# EAGLE design ACS712 - Rian Turibio - 14209393 (EAGLE 9.6.2)
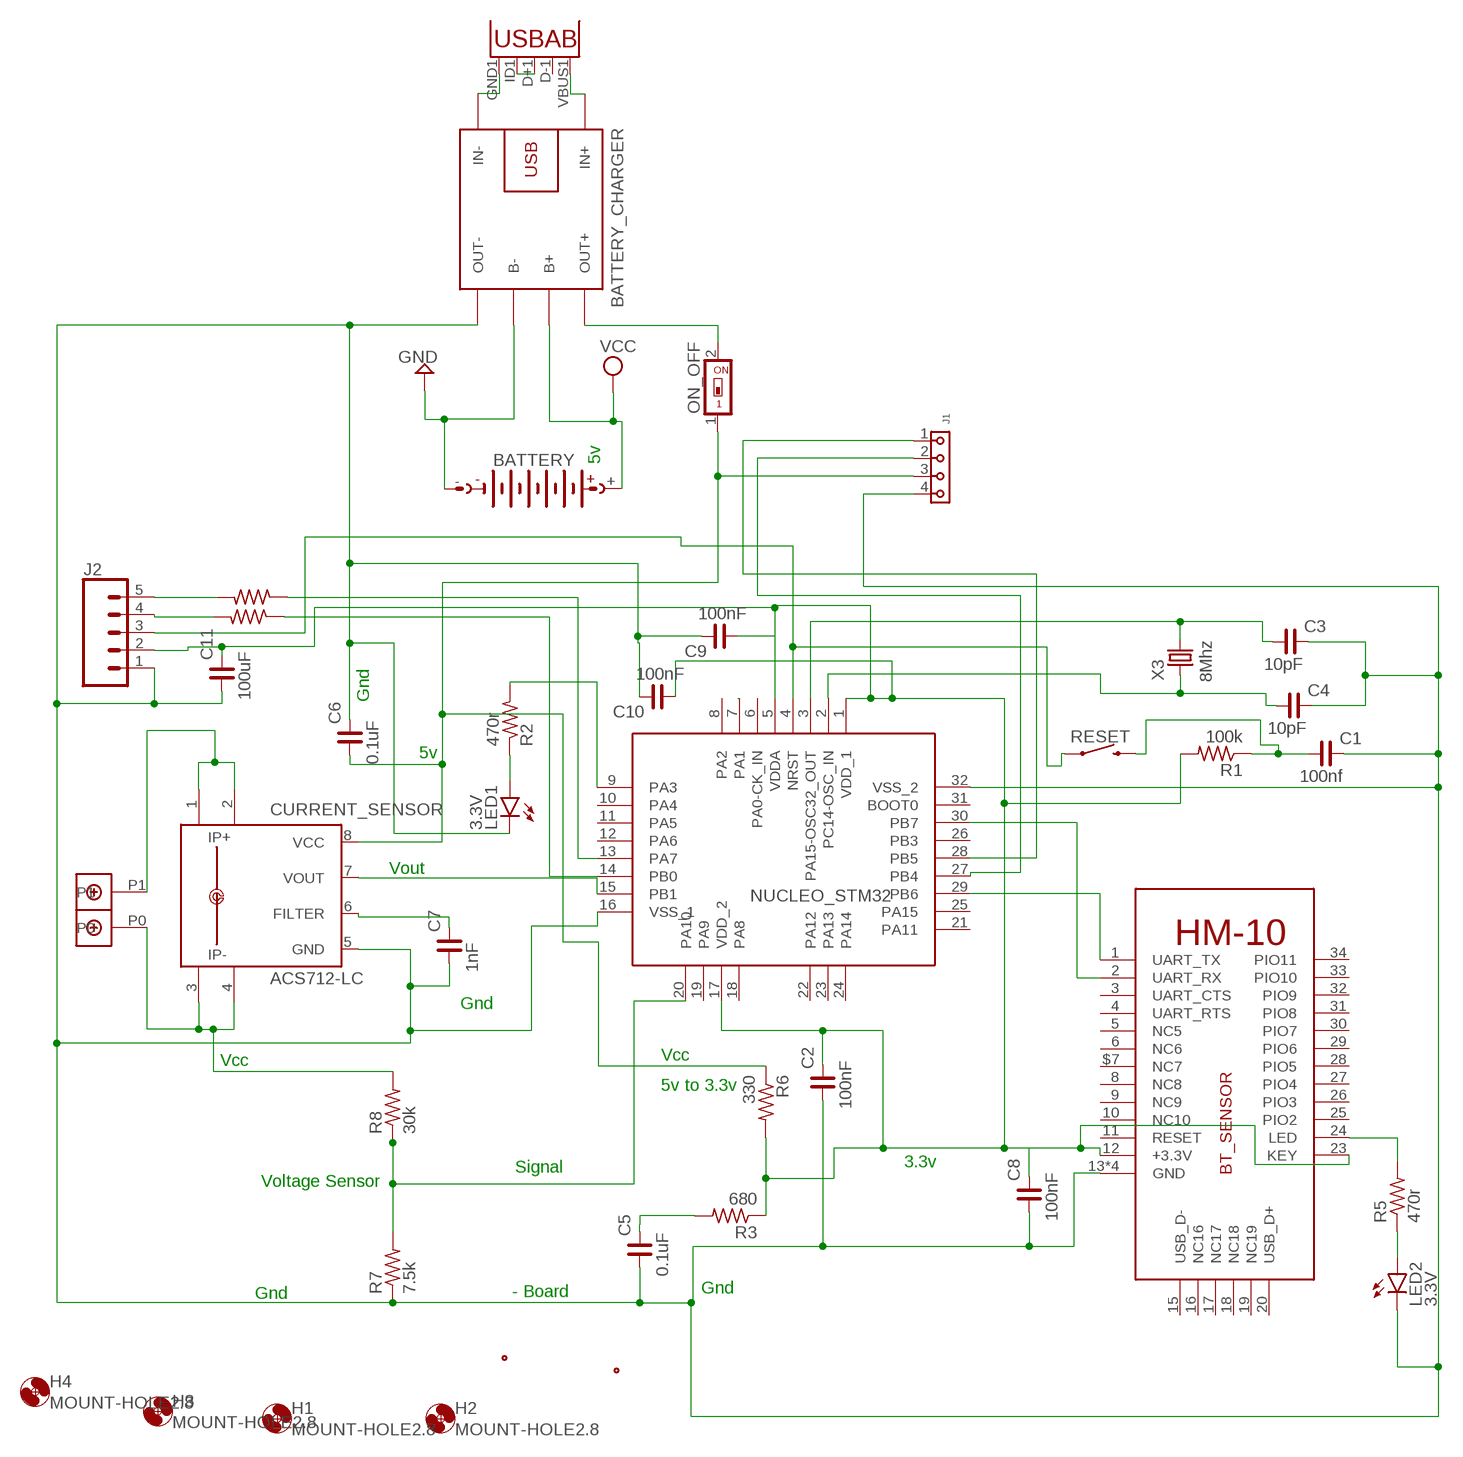
[diagram p0: schematic, sheet 1]

## Parts
BATTERY  AB9V  [AB9V]
BATTERY_CHARGER  BATTERY-CHARGER-LI-PROT  [BATTERY-CHARGER-LI-PROT]
BT_SENSOR  HM-10-BOARD  [26.9X13X2.2_BOARD]
C1  100nf  C_0805  [C0805]
C2  100nF  C_0805  [C0805]
C3  10pF  C_0805  [C0805]
C4  10pF  C_0805  [C0805]
C5  0.1uF  C_0805  [C0805]
C6  0.1uF  C_0805  [C0805]
C7  1nF  C_0805  [C0805]
C8  100nF  C_0805  [C0805]
C9  100nF  C_0805  [C0805]
C10  100nF  C_0805  [C0805]
C11  100uF  C_0805  [C0805]
CURRENT_SENSOR  ACS712-LC  [SOIC8]
H1  MOUNT-HOLE2.8  [2,8]
H2  MOUNT-HOLE2.8  [2,8]
H3  MOUNT-HOLE2.8  [2,8]
H4  MOUNT-HOLE2.8  [2,8]
J1  6130XX11821_61300411821  [61300411821]
J2  CONN_05  [1X05]
LED1  3.3V  LEDCHIPLED_0805  [CHIPLED_0805]
LED2  3.3V  LEDCHIPLED_0805  [CHIPLED_0805]
NUCLEO_STM32  STM32L031K6T6TR  [QFP80P900X900X160-32N]
ON_OFF  SWS001  [SMS-001]
R1  100k  CRCW08050000Z0EA  [RES_0805]
R2  470r  CRCW08050000Z0EA  [RES_0805]
R3  680  CRCW08050000Z0EA  [RES_0805]
R4  10k  CRCW08050000Z0EA  [RES_0805]
R5  470r  CRCW08050000Z0EA  [RES_0805]
R6  330  CRCW08050000Z0EA  [RES_0805]
R7  7.5k  CRCW08050000Z0EA  [RES_0805]
R8  30k  CRCW08050000Z0EA  [RES_0805]
R9  10k  CRCW08050000Z0EA  [RES_0805]
RESET  MOMENTARY-SWITCH-SPST-SMD-6.0X3.5MM  [TACTILE_SWITCH_SMD_6.0X3.5MM]
U1  5v  USB""  [USB-MICRO-SMD]
U$2  DBCONN-1X2  [DBCONN-1X2]
X1  FIDUCIAL_0.6-1.2MM  [FIDUCIAL0.6-1.2]
X2  FIDUCIAL_0.6-1.2MM  [FIDUCIAL0.6-1.2]
X3  8Mhz  5032/2P  [5032/2P]

## Nets
GND: BATTERY.- BATTERY_CHARGER.B-
N$1: BATTERY_CHARGER.OUT+ ON_OFF.2
N$2: NUCLEO_STM32.20(PA10) R7.2 R8.1
N$3: BT_SENSOR.24(LED) R5.2
N$4: U1.D+1(D+) U1.ID1(USBID)
N$5: CURRENT_SENSOR.7(VOUT) NUCLEO_STM32.15(PB1)
N$6: BT_SENSOR.1(UART_TX) NUCLEO_STM32.29(PB6)
N$7: C7.2 CURRENT_SENSOR.6(FILTER)
N$8: J1.1 NUCLEO_STM32.28(PB5)
N$9: CURRENT_SENSOR.1(IP+) CURRENT_SENSOR.2(IP+1) U$2.P1
N$10: J1.2 NUCLEO_STM32.27(PB4)
N$11: BT_SENSOR.12(+3.3V) BT_SENSOR.23(KEY) C2.2 C8.2 C9.1 C10.1 C11.2 J2.2 NUCLEO_STM32.1(VDD_1) NUCLEO_STM32.5(VDDA) NUCLEO_STM32.17(VDD_2) R1.2 R3.1 R6.2
N$12: CURRENT_SENSOR.3(IP-) CURRENT_SENSOR.4(IP-1) R8.2 U$2.P0
N$13: C6.1 CURRENT_SENSOR.8(VCC) J1.3 ON_OFF.1 R6.1
N$14: J2.3 NUCLEO_STM32.4(NRST) RESET.1
N$15: LED2.A R5.1
N$16: BATTERY_CHARGER.IN- U1.GND1(GND)
N$17: BATTERY_CHARGER.IN+ U1.VBUS1(VBUS)
N$18: C4.1 NUCLEO_STM32.2(PC14-OSC_IN) X3.1
N$19: BT_SENSOR.2(UART_RX) NUCLEO_STM32.30(PB7)
N$20: C3.1 NUCLEO_STM32.3(PA15-OSC32_OUT) X3.2
N$21: BATTERY_CHARGER.OUT- BT_SENSOR.13(GND) BT_SENSOR.14(GND) BT_SENSOR.21(GND) BT_SENSOR.22(GND) C1.2 C2.1 C3.2 C4.2 C5.1 C6.2 C7.1 C8.1 C9.2 C10.2 C11.1 CURRENT_SENSOR.5(GND) J1.4 J2.1 LED1.C LED2.C NUCLEO_STM32.16(VSS_1) NUCLEO_STM32.32(VSS_2) R7.1
N$22: NUCLEO_STM32.9(PA3) R2.2
N$23: C5.2 R3.2
N$24: NUCLEO_STM32.7(PA1)
N$25: C1.1 R1.1 RESET.2
N$26: LED1.A R2.1
N$27: NUCLEO_STM32.13(PA7) R4.1
N$28: NUCLEO_STM32.14(PB0) R9.1
N$29: J2.5 R4.2
N$30: J2.4 R9.2
VCC: BATTERY.+ BATTERY_CHARGER.B+
Unconnected: BT_SENSOR.3(UART_CTS) BT_SENSOR.4(UART_RTS) BT_SENSOR.5(NC5) BT_SENSOR.6(NC6) BT_SENSOR.8(NC8) BT_SENSOR.9(NC9) BT_SENSOR.10(NC10) BT_SENSOR.11(RESET) BT_SENSOR.15(USB_D-) BT_SENSOR.16(NC16) BT_SENSOR.17(NC17) BT_SENSOR.18(NC18) BT_SENSOR.19(NC19) BT_SENSOR.20(USB_D+) BT_SENSOR.25(PIO2) BT_SENSOR.26(PIO3) BT_SENSOR.27(PIO4) BT_SENSOR.28(PIO5) BT_SENSOR.29(PIO6) BT_SENSOR.30(PIO7) BT_SENSOR.31(PIO8) BT_SENSOR.32(PIO9) BT_SENSOR.33(PIO10) BT_SENSOR.34(PIO11) BT_SENSOR.$7(NC7) NUCLEO_STM32.6(PA0-CK_IN) NUCLEO_STM32.8(PA2) NUCLEO_STM32.10(PA4) NUCLEO_STM32.11(PA5) NUCLEO_STM32.12(PA6) NUCLEO_STM32.18(PA8) NUCLEO_STM32.19(PA9) NUCLEO_STM32.21(PA11) NUCLEO_STM32.22(PA12) NUCLEO_STM32.23(PA13) NUCLEO_STM32.24(PA14) NUCLEO_STM32.25(PA15) NUCLEO_STM32.26(PB3) NUCLEO_STM32.31(BOOT0) U1.D-1(D-)

## Notes on the sheet
- 5v
- Gnd
- 5v
- Vout
- Gnd
- Vcc
- Vcc
- 5v to 3.3v
- 3.3v
- Signal
- Voltage Sensor
- Gnd
- Gnd
- - Board

## Library data of the parts
BATTERY = battery:AB9V: 9-V BATTERY CLIP
BATTERY_CHARGER = diy-modules:BATTERY-CHARGER-LI-PROT: Lithium Battery 5V Charger with protection circuit More details available here: http://www.instructables.com/id/DIY-Lithium-ion-Battery-Charger/step4/TP4056-based-lithium-ion-battery-charger-module/ Click here to find device on ebay.com <http://www.ebay.com/sch/tp4056+charger+usb+protection>
BT_SENSOR = hm10:HM-10: HM Bluetooth module use TI CC2540 or CC2541, Master and slave roles in one, transmission version and remote control version and PIO state acquisition functions in one, Support the AT command modify module parameters, Convenient and flexible.
C1-C11 = rc-master-smd:C_: NON-POLARIZED CAP
CURRENT_SENSOR = allegro-2:ACS712-LC
H1-H4 = holes:MOUNT-HOLE: MOUNTING HOLE with drill center marker
J1 = Wurth_Connectors_WR-PHD:6130XX11821_61300411821: WR-PHD 2.54 mm Socket Header ARTICLE PROPERTIES: Pins:1;​ 2;​ 3;​ 4;​ 5;​ 6;​ 7;​ 8;​ 9;​ 10;​ 12;​ 13;​ 14;​ 15;​ 16;​ 18;​ 20;​ 22;​ 24;​ 25;​ 32;​ 36;​ 40 KIND PROPERTIES: Pitch：2.54 mm Quality Class:3 as per CECC 75 301-802 Rows：Single Gender：Socket Header;​ Female Type：Straight MATERIAL PROPERTIES: Insulator Material :PBT Insulator Flammability Rating:UL94 V-0 Contact Material:Copper Alloy Contact Plating:Gold Contact Type:Stamped GENERAL INFORMATION Operating Temperature:-40 up to +125 °C Compliance:Lead free / RoHS ELECTRICAL PROPERTIES: Rated Current:3 A IR 1:3 A Withstanding Voltage:500 V (AC) Contact Resistance:20 mΩ RISO:1000 MΩ CERTIFICATION UL Approval:E323964 PACKAGING PROPERTIES Packaging:Tray <https://katalog.we-online.com/media/images/v2/o33218v209%20Family_WR-PHD_613xxx11821.jpg> Details see: https://katalog.we-online.com/en/em/PHD_2_54_SOCKET_HEADER_6130XX11821 Updated by Yingchun,Shan 2019-10-21 2019 (C) Würth Elektronik; DATASHEET-URL: https://katalog.we-online.com/em/datasheet/61300411821.pdf; GENDER: Socket Header; IR: 3A; MATES: WR-PHD 2.54mm SMT Pin Header/THT Angled Pin Header/THT Pin Header; PACKAGING: Tray; PART-NUMBER: 61300411821; PINS: 4; ROWS: Single; TYPE: Straight
J2 = SparkFun-Connectors:CONN_05: Multi connection point. Often used as Generic Header-pin footprint for 0.1 inch spaced/style header connections On any of the 0.1 inch spaced packages, you can populate with these: Break Away Headers - Straight <https://www.sparkfun.com/products/116> (PRT-00116) Break Away Male Headers - Right Angle <https://www.sparkfun.com/products/553> (PRT-00553) Female Headers <https://www.sparkfun.com/products/115> (PRT-00115) Break Away Headers - Machine Pin <https://www.sparkfun.com/products/117> (PRT-00117) Break Away Female Headers - Swiss Machine Pin <https://www.sparkfun.com/products/743> (PRT-00743) For SCREWTERMINALS and SPRING TERMINALS visit here: Screw Terimnals on SparkFun.com <https://www.sparkfun.com/search/results?term=Screw+Terminals> (5mm/3.5mm/2.54mm spacing) This device is also useful as a general connection point to wire up your design to another part of your project. Our various solder wires solder well into these plated through hole pads. Hook-Up Wire - Assortment (Stranded, 22 AWG) <https://www.sparkfun.com/products/11375> (PRT-11375) Hook-Up Wire - Assortment (Solid Core, 22 AWG) <https://www.sparkfun.com/products/11367> (PRT-11367) View the entire wire category on our website here <https://www.sparkfun.com/categories/141> Special notes: Molex polarized connector foot print use with SKU : PRT-08231 with associated crimp pins and housings. 1MM SMD Version SKU: PRT-10208
LED1 LED2 = led:LED: LED OSRAM: - CHIPLED LG R971, LG N971, LY N971, LG Q971, LY Q971, LO R971, LY R971 LH N974, LH R974 LS Q976, LO Q976, LY Q976 LO Q996 - Hyper CHIPLED LW Q18S LB Q993, LB Q99A, LB R99A - SideLED LS A670, LO A670, LY A670, LG A670, LP A670 LB A673, LV A673, LT A673, LW A673 LH A674 LY A675 LS A676, LA A676, LO A676, LY A676, LW A676 LS A679, LY A679, LG A679 - Hyper Micro SIDELED® LS Y876, LA Y876, LO Y876, LY Y876 LT Y87S - SmartLED LW L88C, LW L88S LB L89C, LB L89S, LG L890 LS L89K, LO L89K, LY L89K LS L896, LA L896, LO L896, LY L896 - TOPLED LS T670, LO T670, LY T670, LG T670, LP T670 LSG T670, LSP T670, LSY T670, LOP T670, LYG T670 LG T671, LOG T671, LSG T671 LB T673, LV T673, LT T673, LW T673 LH T674 LS T676, LA T676, LO T676, LY T676, LB T676, LH T676, LSB T676, LW T676 LB T67C, LV T67C, LT T67C, LS T67K, LO T67K, LY T67K, LW E67C LS E67B, LA E67B, LO E67B, LY E67B, LB E67C, LV E67C, LT E67C LW T67C LS T679, LY T679, LG T679 LS T770, LO T770, LY T770, LG T770, LP T770 LB T773, LV T773, LT T773, LW T773 LH T774 LS E675, LA E675, LY E675, LS T675 LS T776, LA T776, LO T776, LY T776, LB T776 LHGB T686 LT T68C, LB T68C - Hyper Mini TOPLED® LB M676 - Mini TOPLED Santana® LG M470 LS M47K, LO M47K, LY M47K Source: http://www.osram.convergy.de LUXEON: - LUMILED® LXK2-PW12-R00, LXK2-PW12-S00, LXK2-PW14-U00, LXK2-PW14-V00 LXK2-PM12-R00, LXK2-PM12-S00, LXK2-PM14-U00 LXK2-PE12-Q00, LXK2-PE12-R00, LXK2-PE12-S00, LXK2-PE14-T00, LXK2-PE14-U00 LXK2-PB12-K00, LXK2-PB12-L00, LXK2-PB12-M00, LXK2-PB14-N00, LXK2-PB14-P00, LXK2-PB14-Q00 LXK2-PR12-L00, LXK2-PR12-M00, LXK2-PR14-Q00, LXK2-PR14-R00 LXK2-PD12-Q00, LXK2-PD12-R00, LXK2-PD12-S00 LXK2-PH12-R00, LXK2-PH12-S00 LXK2-PL12-P00, LXK2-PL12-Q00, LXK2-PL12-R00 Source: www.luxeon.com KINGBRIGHT: KA-3528ASYC Source: www.kingbright.com
NUCLEO_STM32 = STM32L031K6T6TR:STM32L031K6T6TR: STMICROELECTRONICS - STM32L031K6T6TR - ARM MCU, STM32 Family STM32L0 Series Microcontrollers, ARM Cortex-M0+, 32bit, 32 MHz, 32 KB, 8 KB Source: Datasheet <https://4donline.ihs.com/images/VipMasterIC/IC/SGST/SGST-S-A0002219924/SGST-S-A0002219924-1.pdf?hkey=6D3A4C79FDBF58556ACFDE234799DDF0>; ARROW_PART_NUMBER: STM32L031K6T6TR; ARROW_PRICE-STOCK: https://www.arrow.com/en/products/stm32l031k6t6tr/stmicroelectronics; DESCRIPTION: STMICROELECTRONICS - STM32L031K6T6TR - ARM MCU, STM32 Family STM32L0 Series Microcontrollers, ARM Cortex-M0+, 32bit, 32 MHz, 32 KB, 8 KB; HEIGHT: 1.6mm; MANUFACTURER_NAME: STMicroelectronics; MANUFACTURER_PART_NUMBER: STM32L031K6T6TR; MOUSER_PART_NUMBER: 511-STM32L031K6T6TR; MOUSER_PRICE-STOCK: https://www.mouser.co.uk/ProductDetail/STMicroelectronics/STM32L031K6T6TR/?qs=xwQlLnDx56Cmxri8cgW0QQ%3D%3D
ON_OFF = smd-special:SWS001: SMD Dip Switch 1 pol.
R1-R9 = Resistor_Capacitor:CRCW08050000Z0EA: RES SMD 0 OHM JUMPER 1/8W 0805 Manufacturer's datasheet <http://www.vishay.com/docs/20035/dcrcwe3.pdf>; CREATED_BY: PCBLayout.com; DIGIKEY_PART_NUMBER: 541-0.0ATR-ND; MANUFACTURER: Vishay Dale; MPN: CRCW08050000Z0EA; PACKAGE: SMD 0805
RESET = SparkFun-Switches:MOMENTARY-SWITCH-SPST: Momentary Switch (Pushbutton) - SPST Normally-open (NO) SPST momentary switches (buttons, pushbuttons). Variants PTH-12MM - 12mm square, through-hole Momentary Pushbutton Switch - 12mm Square <https://www.sparkfun.com/products/9190> (COM-09190) PTH-6.0MM, PTH-6.0MM-KIT - 6.0mm square, through-hole Mini Pushbutton Switch <https://www.sparkfun.com/products/97> (COM-00097) KIT package intended for soldering kit's - only one side of pads' copper is exposed. PTH-RIGHT-ANGLE-KIT - Right-angle, through-hole Right Angle Tactile Button <https://www.sparkfun.com/products/10791> - Used on SparkFun BigTime Watch Kit <https://www.sparkfun.com/products/11734> SMD-12MM - 12mm square, surface-mount Tactile Button - SMD (12mm) <https://www.sparkfun.com/products/12993> (COM-12993) Used on SparkFun PicoBoard <https://www.sparkfun.com/products/11888> SMD-4.5MM - 4.5mm Square Trackball Switch Used on SparkFun Blackberry Trackballer Breakout <https://www.sparkfun.com/products/13169> SMD-4.6MMX2.8MM - 4.60mm x 2.80mm, surface mount Used on SparkFun SAMD21 Mini Breakout <https://www.sparkfun.com/products/13664> SMD-5.2MM, SMD-5.2-REDUNDANT - 5.2mm square, surface-mount Mini Pushbutton Switch - SMD <https://www.sparkfun.com/products/8720> (COM-08720) Used on Arduino Pro Mini <https://www.sparkfun.com/products/11114> REDUNDANT package connects both switch circuits together SMD-6.0X3.5MM - 6.0 x 3.5mm, surface mount Momentary Reset Switch SMD <https://www.sparkfun.com/products/8229> (COM-08229) SMD-6.2MM-TALL - 6.2mm square, surface mount Tactile Button - SMD (6mm) <https://www.sparkfun.com/products/12992> Used on SparkFun Digital Sandbox <https://www.sparkfun.com/products/12651> SMD-RIGHT-ANGLE - Right-angle, surface mount Used on SparkFun Block for Intel® Edison - Arduino <https://www.sparkfun.com/products/13036>; PROD_ID: SWCH-00815; SF_SKU: COM-08229
U1 = MicroUSB:USB: This is a USB AB connector that is compatible with USB OTG. i.e. this connector can serve as a host or device
U$2 = Terminal Block Connector:DBCONN-1X2
X1 X2 = nxp_60:FIDUCIAL_0.6-1.2MM
X3 = Crystals_Oscillators:5032/2P: Crystal Manufacturer's datasheet <https://datasheet.octopart.com/5032-2P-Xinhunjing-datasheet-30677175.pdf>; CREATED_BY: PCBLayout.com; MANUFACTURER: Xinhunjing; MPN: 5032/2P; PACKAGE: SMD

## Module VOLTAGE_SENSOR
Ports: 

### Library data of the parts

## Board
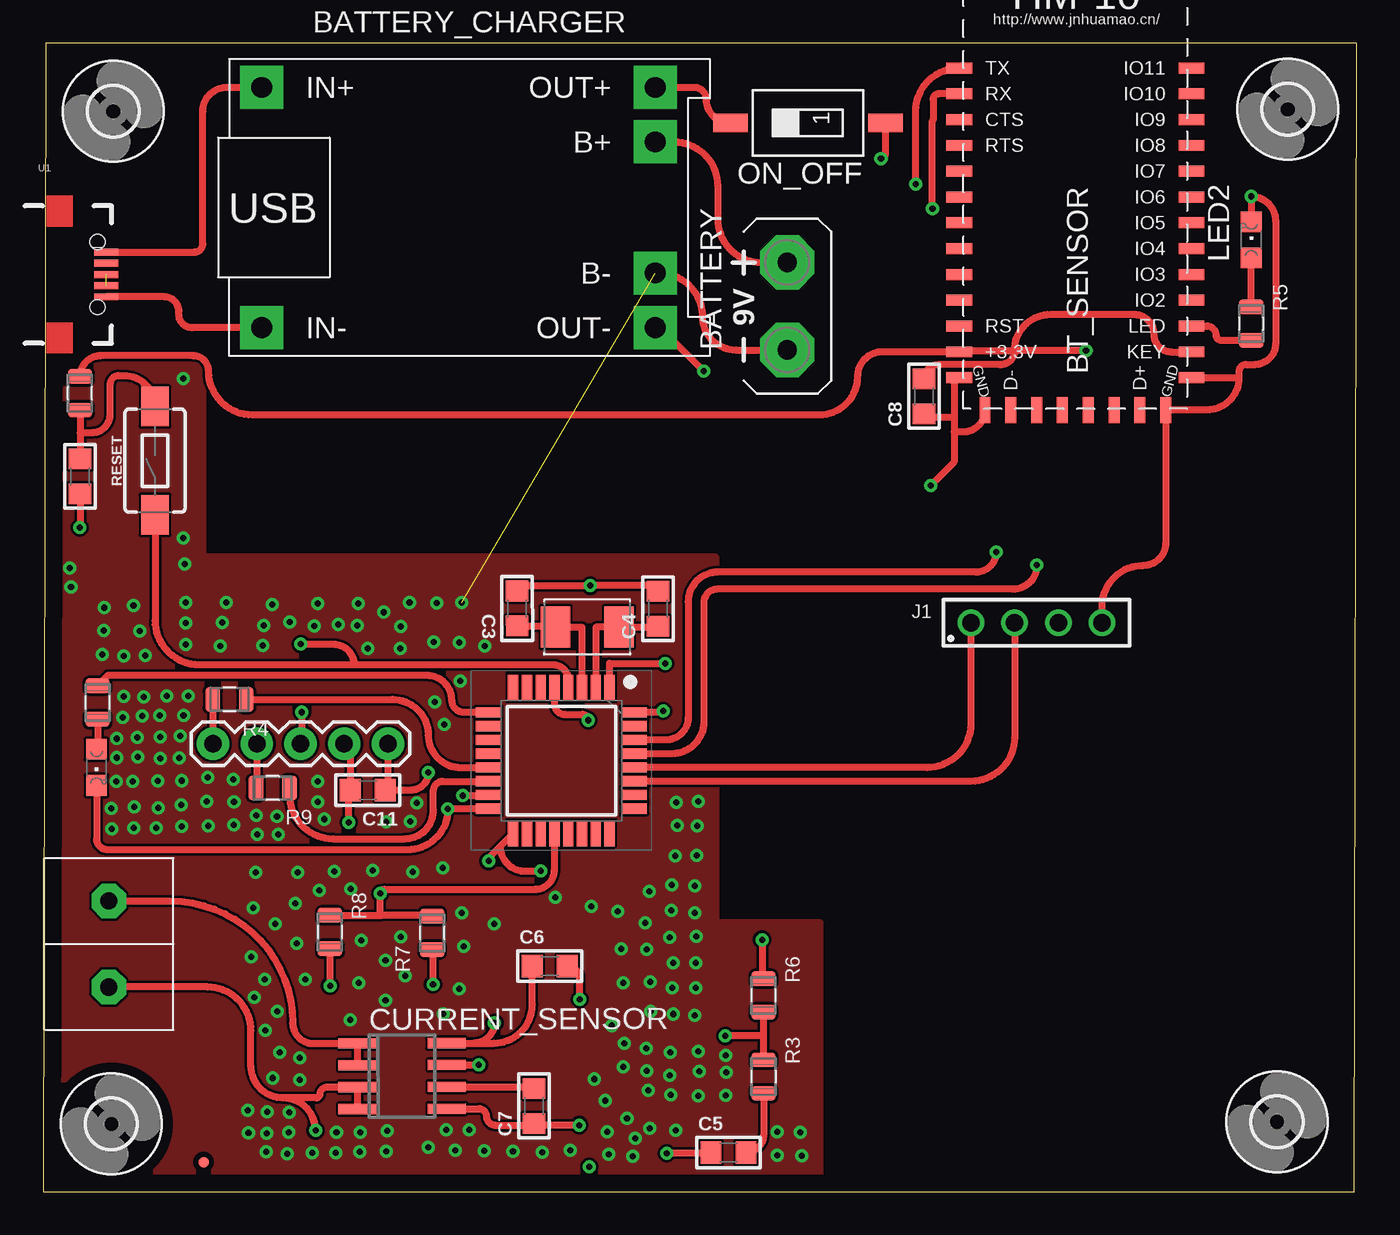
[diagram p1: board, top side]
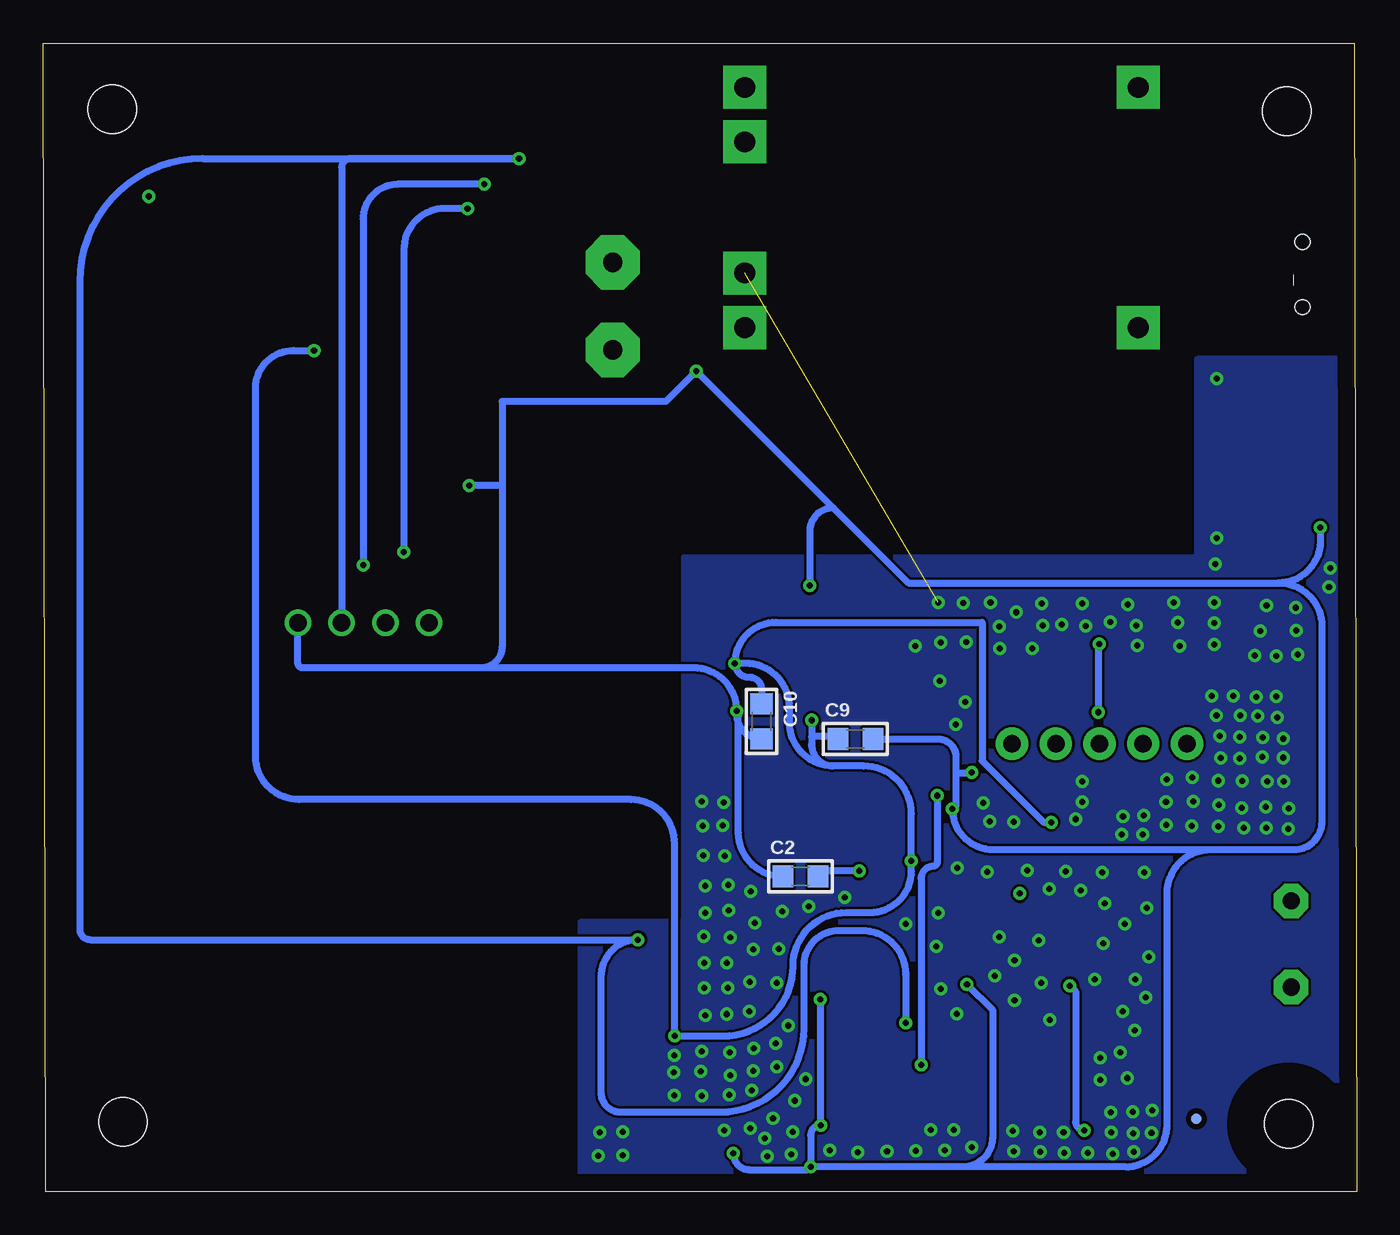
[diagram p2: board, bottom side, seen from below]

Size 76.35 x 66.79 mm. Coordinates in mm from the lower left corner, seen from the top.
Outline: 0,0 76.18,0 76.35,66.79 0.17,66.79 0,0
Copper layers (1*16): Top 0.035mm / dielectric 1.5mm / Bottom 0.035mm
Design rules "default": minimum track width 6mil, minimum drill 0.35mm, track to track 6mil, track to pad 6mil, pad to pad 6mil, via to via 6mil, smd to smd 6mil, copper to edge 40mil, drill to drill 6mil, minimum pad ring 10mil, minimum via ring 8mil, stop-mask expansion 4mil, vias tented up to drill 0mil, thermal gap 10mil

### Footprints (pad centres in the part's own frame; a part is rotated, then mirrored left to right if it is on the bottom)
AB9V = drill 1.118 pad 3.15 octagon: + 0,2.54; - 0,-2.54
BATTERY-CHARGER-LI-PROT = drill 1.2 pad 2.5 square: B+ 10.795,3.81; B- 10.795,-3.81; IN+ -12.065,6.985; IN- -12.065,-6.985; OUT+ 10.795,6.985; OUT- 10.795,-6.985
26.9X13X2.2_BOARD = smd 1.5 x 0.635: 1 -7.5,0; 2 -7.5,-1.5; 3 -7.5,-3; 4 -7.5,-4.5; 5 -7.5,-6; 6 -7.5,-7.5; 8 -7.5,-10.5; 9 -7.5,-12; 10 -7.5,-13.5; 11 -7.5,-15; 12 -7.5,-16.5; 13 -7.5,-18; 22 6,-18; 23 6,-16.5; 24 6,-15; 25 6,-13.5; 26 6,-12; 27 6,-10.5; 28 6,-9; 29 6,-7.5; 30 6,-6; 31 6,-4.5; 32 6,-3; 33 6,-1.5; 34 6,0; $7 -7.5,-9 | smd 0.635 x 1.5: 14 -6,-19.875; 15 -4.5,-19.875; 16 -3,-19.875; 17 -1.5,-19.875; 18 0,-19.875; 19 1.5,-19.875; 20 3,-19.875; 21 4.5,-19.875
C0805 = smd 1.2 x 1.3: 1 -1.016,0; 2 1.016,0
SOIC8 = smd 0.6 x 2.2: 1 -1.905,-2.6; 2 -0.635,-2.6; 3 0.635,-2.6; 4 1.905,-2.6; 5 1.905,2.6; 6 0.635,2.6; 7 -0.635,2.6; 8 -1.905,2.6
2,8 = hole 2.8: 0,0
61300411821 = drill 1.02: 1 -3.81,0; 2 -1.27,0; 3 1.27,0; 4 3.81,0
1X05 = drill 1.016 pad 1.88: 1 0,0; 2 2.54,0; 3 5.08,0; 4 7.62,0; 5 10.16,0
CHIPLED_0805 = smd 1.2 x 1.2: A 0,-1.05; C 0,1.05
QFP80P900X900X160-32N = smd 1.475 x 0.6: 1 -4.238,2.8; 2 -4.238,2; 3 -4.238,1.2; 4 -4.238,0.4; 5 -4.238,-0.4; 6 -4.238,-1.2; 7 -4.238,-2; 8 -4.238,-2.8; 17 4.238,-2.8; 18 4.238,-2; 19 4.238,-1.2; 20 4.238,-0.4; 21 4.238,0.4; 22 4.238,1.2; 23 4.238,2; 24 4.238,2.8 | smd 0.6 x 1.475: 9 -2.8,-4.238; 10 -2,-4.238; 11 -1.2,-4.238; 12 -0.4,-4.238; 13 0.4,-4.238; 14 1.2,-4.238; 15 2,-4.238; 16 2.8,-4.238; 25 2.8,4.238; 26 2,4.238; 27 1.2,4.238; 28 0.4,4.238; 29 -0.4,4.238; 30 -1.2,4.238; 31 -2,4.238; 32 -2.8,4.238
SMS-001 = smd 1.092 x 2.007: 1 0,-4.496; 2 0,4.496
RES_0805 = smd 0.87 x 1.42: 1 -0.975,0; 2 0.975,0
TACTILE_SWITCH_SMD_6.0X3.5MM = smd 2.3 x 1.6: 1 -3.15,0; 2 3.15,0
USB-MICRO-SMD = smd 1.4 x 0.4: D+1 2.7,0; D-1 2.7,0.65; GND1 2.7,-1.3; ID1 2.7,-0.65; VBUS1 2.7,1.3 | hole 0.85: 2.2,1.9; 2.2,-1.9
DBCONN-1X2 = drill 1 pad 2 octagon: P0 -2.54,0; P1 2.46,0
FIDUCIAL0.6-1.2 = smd 0.6 x 0.6: 1 0,0
5032/2P = smd 1.7 x 2.4: 1 -1.85,0; 2 1.85,0

### Placement (x,y rotation side)
BATTERY  43.25,51.49 0 top
BATTERY_CHARGER  24.78,57.23 0 top
BT_SENSOR  60.74,65.33 0 top
C1  2.16,41.6 270 top
C2  32.34,18.34 0 bottom
C3  27.55,33.92 90.3 top
C4  35.73,33.9 90 top
C5  39.83,2.28 0.1 top
C6  29.45,13.13 0 top
C7  28.53,5 90 top
C8  51.2,46.26 90 top
C9  29.15,26.33 0 bottom
C10  34.59,27.35 270 bottom
C11  18.87,23.35 180 top
CURRENT_SENSOR  20.86,6.74 270.2 top
H1  72.32,62.93 0 top
H2  4.09,62.82 0 top
H3  3.97,3.95 0 top
H4  71.7,4.08 0 top
J1  57.73,33.08 0 top
J2  20.04,26.06 180 top
LED1  3.11,24.68 180 top
LED2  70.21,55.34 0 top
NUCLEO_STM32  30.12,25.07 270 top
ON_OFF  44.45,62.15 90 top
R1  2.14,46.43 90 top
R2  3.17,28.45 90 top
R3  41.87,6.71 270 top
R4  10.84,28.63 180 top
R5  70.2,50.48 270 top
R6  41.86,11.42 270 top
R7  22.62,15.06 90 top
R8  16.67,15.11 270 top
R9  13.35,23.48 180 top
RESET  6.51,42.51 90 top
U1  0.97,53.33 0 top
U$2  3.83,14.45 90 top
X1  9.33,4.25 0 bottom
X2  9.33,1.73 0 top
X3  31.62,32.84 180 top

### Tracks (layer width: path | path; a pad name or v marks a point on that pad's centre or on a via)
GND  (via drill 0.35)  (1 unrouted)
  Top 0.406: BATTERY_CHARGER.B- 35.79,53.42 arc-90 38.31,50.9 arc90 40.26,48.95 BATTERY.-
  other vias: 8.16,47.28 8.16,38.02 8.22,36.5 8.28,34.26 10.64,34.26 13.31,34.14 15.97,34.2 18.33,34.2 21.3,34.26 24.32,34.26 5.26,34.08 3.56,33.96 1.56,36.26 1.63,35.17 3.53,32.65 3.44,31.24 4.7,31.16 5.95,31.19 5.63,32.62 8.29,33.08 8.29,31.83 10.3,31.74 10.42,33.11 12.84,32.94 12.78,31.77 15.76,32.91 18.27,32.94 20.77,32.88 18.88,31.6 20.75,31.6 14.33,33.14 17.16,33 19.81,33.7 22.7,31.98 24.19,31.95 25.68,31.74 24.25,29.72 22.76,28.48 23.3,27.17 21.71,22.61 21.34,21.54 19.93,21.51 16.34,21.67 15.98,22.68 15.98,23.86 13.6,21.83 13.66,20.78 12.45,20.78 12.4,21.88 11.05,23.98 9.56,24.09 9.51,22.69 11.1,22.67 11.08,21.32 9.59,21.27 8.06,21.26 6.59,21.16 5.27,21.16 3.99,21.1 3.95,22.3 5.31,22.37 6.69,22.32 8.02,22.51 8.07,23.91 6.67,23.89 5.22,23.87 4.26,23.87 4.29,25.24 5.49,25.28 6.82,25.21 7.9,25.22 4.3,26.35 5.48,26.41 6.81,26.46 7.98,26.5 4.63,27.59 5.77,27.68 6.79,27.71 8.16,27.7 8.44,28.82 7.2,28.82 5.84,28.78 4.7,28.81 22.88,34.24 36.81,22.64 38.08,22.71 38.01,21.27 36.86,21.31 36.73,19.54 37.98,19.55 36.52,17.86 37.86,17.8 37.88,16.23 36.5,16.38 36.42,14.8 37.96,14.86 37.94,13.32 36.62,13.32 36.56,11.86 37.94,11.88 37.88,10.26 36.62,10.34 35.31,10.5 35.29,12.2 35.09,14.09 34.98,15.65 35.23,17.47 33.4,16.31 33.59,14.13 33.73,12.16 31.84,16.6 26.22,15.59 29.77,17.12 38.06,8.17 38.14,7.01 38.06,5.58 36.48,5.64 36.42,6.77 36.44,8.11 35.06,8.35 35.09,7.05 35.17,5.92 33.73,7.28 33.79,8.64 33.06,9.67 39.66,7.95 39.72,6.96 39.66,5.62 42.65,3.48 43.99,3.46 44.09,2.1 42.65,2.12 36.78,3.59 35.26,3.71 33.93,4.28 32.67,5.31 32.03,6.56 32.78,3.5 32.88,2.19 34.27,2.08 34.43,3.11 30.64,2.41 29.01,2.32 27.31,2.36 25.63,2.39 23.95,2.41 22.4,2.58 23.42,3.6 24.76,3.6 19.99,3.54 19.95,2.37 18.42,2.33 18.45,3.47 17.05,3.47 17,2.29 15.65,2.29 14.18,2.22 14.27,3.46 14.3,4.62 11.89,4.75 13.04,4.66 13,3.4 12.97,2.33 11.94,3.43 13.34,6.62 14.93,6.52 14.91,7.78 13.75,8.11 12.9,9.4 13.61,10.49 12.28,11.31 12.89,12.36 12.11,13.66 12.23,16.5 12.37,18.58 14.79,18.58 14.65,16.77 14.73,14.46 15.23,12.36 17.86,9.99 19.9,11.13 18.35,12.15 19.9,13.47 18.5,14.64 20.77,14.84 21.04,12.56 23.26,10.34 24.19,11.8 24.45,14.28 24.34,16.21 23.23,18.84 21.48,18.61 19.17,18.69 16.92,18.63 17.89,17.61 16.05,17.53 13.49,15.59
  pour Top: 0.38,48.37 9.29,48.37 9.29,45.6 9.29,36.94 39.09,36.94 39.09,15.66 45.14,15.66 45.14,0.28 0.29,0.28 0.29,48.37 0.34,48.37
  pour Bottom: 0.34,48.37 9.29,48.37 9.29,36.85 39.1,36.85 39.1,15.66 45.12,15.66 45.12,0.27 0.29,0.27 0.29,0.32 0.29,48.36 0.3,48.36
N$1
  Top 0.406: BATTERY_CHARGER.OUT+ 37.83,64.21 arc90 37.84,64.22 arc-90 38.53,63.52 arc90 39.91,62.15 ON_OFF.2
N$2  (via drill 0.35)
  Top 0.406: R8.1 19.67,16.09 | 19.67,16.09 22.57,16.09 arc-90 R7.2 | 19.67,16.09 arc-90 19.59,16.16 v19.59,17.34 arc-90 19.84,17.59 28.59,17.59 arc90 29.72,18.72 NUCLEO_STM32.20
N$3
  Top 0.406: BT_SENSOR.24 67.64,50.33 arc-90 68.16,49.82 arc90 68.47,49.5 R5.2
N$4  (1 unrouted)
N$5  (via drill 0.35)
  Top 0.406: CURRENT_SENSOR.7 v25.32,7.38 arc90 v25.33,7.39 | v24.39,23.04 25.84,23.04 arc90 NUCLEO_STM32.15
  Bottom 0.406: v24.39,23.04 24.39,19.16 arc90 24.62,18.93 arc-90 25.33,18.22 v25.33,7.39
N$6  (via drill 0.35)
  Top 0.406: v57.75,36.44 arc-90 56.34,35.03 39.17,35.03 arc90 38.39,34.26 38.39,27.32 arc-90 36.55,25.47 NUCLEO_STM32.29 | v50.7,58.57 50.7,62.8 arc-90 BT_SENSOR.1
  Bottom 0.406: v50.7,58.57 55.74,58.57 arc-90 57.75,56.56 v57.75,36.44
N$7
  Top 0.406: CURRENT_SENSOR.6 28.44,6.11 arc-90 C7.2
N$8
  Top 0.406: J1.1 53.92,27.21 arc-90 51.38,24.67 NUCLEO_STM32.28
N$9
  Top 0.406: U$2.P1 7.41,16.91 arc-90 14.51,9.81 arc90 15.69,8.63 CURRENT_SENSOR.1 CURRENT_SENSOR.2 arc90 CURRENT_SENSOR.2
N$10
  Top 0.406: J1.2 56.46,26.41 arc-90 53.92,23.87 NUCLEO_STM32.27
N$11  (via drill 0.35)
  Top 0.406: R6.2 41.86,9.06 | 41.86,9.06 R3.1 arc90 R3.1 | 41.86,9.06 v39.66,9.06 arc-90 v39.65,9.06 | NUCLEO_STM32.17 26.56,20.08 | 26.56,20.08 25.89,19.41 v25.89,19.24 | v60.61,48.91 56.45,48.91 | 56.45,48.91 53.26,48.91 arc90 53.21,48.86 arc-90 BT_SENSOR.12 48.78,48.83 arc90 47.32,47.38 arc-90 45.11,45.16 12.17,45.16 arc-90 9.63,47.7 arc90 8.72,48.61 3.35,48.61 arc90 R1.2 | NUCLEO_STM32.1 32.92,30.72 v36.14,30.72 | 56.45,48.91 arc-90 55.62,48.08 52.01,48.08 arc90 C8.2 | NUCLEO_STM32.5 29.72,28.36 arc90 30.32,27.76 31.35,27.76 arc-90 v31.69,27.42 | 26.56,20.08 arc90 28,18.65 v28.93,18.65 | v17.76,21.49 17.76,23.26 arc-90 C11.2 17.86,25.71 arc90 J2.2 | 56.45,48.91 arc-90 58.56,51.02 63.4,51.02 arc-90 64.54,49.88 arc90 65.59,48.83 BT_SENSOR.23
  Bottom 0.406: 30.43,24.76 28.67,24.76 arc90 25.89,21.98 v25.89,19.24 25.89,18.65 arc90 28.3,16.25 29.67,16.25 arc-90 32.77,13.14 32.77,13.13 arc90 36.84,9.06 v39.65,9.06 39.65,20.27 arc-90 42.19,22.81 61.47,22.81 arc90 64.01,25.35 64.01,46.72 arc90 61.81,48.91 v60.61,48.91 | 30.43,24.76 arc90 32.97,27.3 32.97,28.18 arc-90 35.51,30.72 v36.14,30.72 | v31.69,27.42 31.69,26.48 | 31.69,26.48 31.69,26.01 arc-90 30.43,24.76 | C9.1 arc-90 30.31,26.48 31.69,26.48 | v36.14,30.72 arc-90 35.34,29.92 35.3,29.92 arc90 34.59,29.22 C10.1 | v28.93,18.65 31.01,18.65 arc-90 C2.2 | v36.14,30.72 arc90 33.75,33.11 21.79,33.11 21.79,25.06 18.21,21.49 v17.76,21.49
N$12  (via drill 0.35)
  Top 0.406: v15.83,3.57 arc90 13.94,5.47 | R8.2 16.67,12 arc90 v16.68,11.99 | 13.94,5.47 15.88,5.47 arc90 16.09,5.67 arc-90 16.51,6.09 CURRENT_SENSOR.3 CURRENT_SENSOR.4 arc90 CURRENT_SENSOR.4 | 13.94,5.47 arc-90 12.09,7.32 12.09,9.37 arc90 9.55,11.91 U$2.P0
  Bottom 0.406: v16.68,11.99 16.34,11.65 16.34,4.08 arc-90 v15.83,3.57
N$13  (via drill 0.35)
  Top 0.406: ON_OFF.1 48.95,60.33 v48.69,60.07 | CURRENT_SENSOR.8 25.05,8.65 | 25.05,8.65 26.19,8.65 arc90 28.43,10.89 C6.1 | v26.23,9.83 arc-90 25.05,8.65 | v41.78,14.67 41.78,12.48 arc90 R6.1
  Bottom 0.406: J1.3 59,59.55 arc90 58.47,60.07 v48.69,60.07 67.07,60.07 arc-90 74.22,52.93 74.22,15.27 arc-90 73.61,14.67 v41.78,14.67 arc-90 43.93,12.52 43.93,5.78 arc-90 42.8,4.65 36.98,4.65 arc-90 32.13,9.5 32.13,13.18 arc90 30.1,15.2 28.77,15.2 arc90 26.23,12.66 v26.23,9.83
N$14  (via drill 0.35)
  Top 0.406: RESET.1 6.51,33.22 arc90 9.07,30.66 18.07,30.66 | 18.07,30.66 29.62,30.66 arc-90 30.52,29.76 NUCLEO_STM32.4 | v15.04,27.89 15.04,26.14 arc-90 J2.3 | v14.98,31.84 16.89,31.84 arc-90 18.07,30.66
  Bottom 0.406: v14.98,31.84 arc-90 15.04,31.78 v15.04,27.89
N$15
  Top 0.406: R5.1 70.2,54.28 arc90 LED2.A
N$16
  Top 0.406: BATTERY_CHARGER.IN- 8.65,50.24 arc-90 7.9,50.99 7.9,51.18 arc90 7.05,52.03 U1.GND1
N$17
  Top 0.406: BATTERY_CHARGER.IN+ 10.67,64.21 arc90 9.28,62.82 9.28,55.11 arc-90 8.8,54.63 U1.VBUS1
N$18
  Top 0.406: NUCLEO_STM32.2 32.12,32.84 X3.1 35.72,32.84 C4.1
N$19  (via drill 0.35)
  Top 0.406: v51.69,57.17 51.69,62.28 arc90 51.72,62.32 51.72,63.52 arc-90 52.03,63.83 BT_SENSOR.2 | v55.38,37.2 arc-90 54.21,36.03 39.2,36.03 arc90 37.49,34.32 37.49,27.57 arc-90 36.2,26.27 NUCLEO_STM32.30
  Bottom 0.406: v51.69,57.17 52.99,57.17 arc-90 55.38,54.78 v55.38,37.2
N$20
  Top 0.406: NUCLEO_STM32.3 31.32,32.84 X3.2 29.77,32.9 C3.1
N$21  (via drill 0.35)
  Top 0.406: v38.39,47.72 35.86,50.24 BATTERY_CHARGER.OUT- | v22.66,12.07 22.66,14.04 arc90 R7.1 | v31.18,11.19 31.18,12.41 arc90 C6.2 | v31.15,3.88 28.63,3.88 | 28.63,3.88 arc-90 C7.1 | C5.1 arc-90 38.78,2.25 v36.25,2.25 | CURRENT_SENSOR.5 25.32,4.84 arc-90 25.77,4.39 arc90 26.28,3.88 28.63,3.88 | v36.03,27.96 arc-90 35.95,27.87 NUCLEO_STM32.32 | J1.4 61.54,34.02 arc-90 63.94,36.42 arc90 65.24,37.72 BT_SENSOR.21 67.62,45.46 arc90 69.5,47.33 | v51.58,41.07 52.94,42.43 52.94,44.19 | 52.94,45.04 52.94,47.04 arc-90 BT_SENSOR.13 | 52.94,45.04 52.94,44.19 | LED2.C arc-90 70.2,56.41 v70.2,57.87 arc-90 71.62,56.44 71.62,49.3 arc-90 70.43,48.1 69.91,48.1 arc90 69.5,47.69 69.5,47.33 | BT_SENSOR.22 69.49,47.33 arc-90 69.5,47.33 | 52.94,44.19 53.47,44.19 arc90 BT_SENSOR.14 | NUCLEO_STM32.16 23.55,22.27 | 23.55,22.27 v23.51,22.27 v23.51,22.28 | C3.2 arc-90 27.85,35.24 v31.8,35.24 35.4,35.24 arc-90 C4.2 | C1.2 2.16,38.65 arc-90 v2.13,38.62 | C8.1 arc90 51.4,45.04 52.94,45.04 | LED1.C 3.11,20.52 arc90 3.73,19.9 21.18,19.9 arc90 23.55,22.27 | J2.1 20.04,23.51 arc-90 C11.1 21.36,23.35 arc90 v22.38,24.37
  Bottom 0.406: 49.68,40.93 49.68,45.97 40.14,45.97 v38.39,47.72 30.43,39.77 | 49.68,40.93 49.68,31.69 arc90 50.9,30.47 | 50.9,30.47 61.28,30.47 arc90 61.54,30.73 J1.4 | 49.68,40.93 arc-90 49.81,41.07 v51.58,41.07 | 30.43,39.77 26.07,35.4 4.57,35.4 | 22.89,1.46 13.45,1.46 arc-90 11.04,3.87 11.04,17.36 arc90 8.5,19.9 | 22.89,1.46 v31.74,1.46 | v22.66,12.07 21.18,10.59 21.18,3.17 arc90 22.89,1.46 | v31.74,1.46 31.74,3.29 arc90 v31.15,3.88 arc90 31.18,3.91 v31.18,11.19 | v36.25,2.25 arc-90 35.29,1.29 31.92,1.29 v31.74,1.46 | 50.9,30.47 38.54,30.47 arc90 v36.03,27.96 36.03,27.77 | 8.5,19.9 3.65,19.9 arc-90 2.03,21.52 2.03,28.09 arc90 2.03,28.09 2.03,32.87 arc-90 4.57,35.4 | 8.5,19.9 21.14,19.9 arc90 v23.51,22.28 arc-90 23.3,22.49 23.3,24.36 | 30.43,39.77 arc-90 31.8,38.4 v31.8,35.24 | v2.13,38.62 2.13,37.84 arc90 4.57,35.4 | C9.2 24.36,26.33 arc90 23.3,25.28 23.3,24.36 | C10.2 arc90 36.03,27.77 | C2.1 33.4,18.34 arc90 35.94,20.88 35.94,27.68 arc-90 36.03,27.77 | 23.3,24.36 22.39,24.36 arc-90 v22.38,24.37
N$22
  Top 0.406: NUCLEO_STM32.9 24.46,27.87 arc-90 23.76,28.58 arc90 22.31,30.03 3.77,30.03 R2.2
N$23
  Top 0.406: R3.2 41.87,3.3 arc-90 C5.2
N$25
  Top 0.406: R1.1 arc-90 2.16,45.44 2.16,44.14 | 2.16,44.14 C1.1 | 2.16,44.14 2.84,44.14 arc90 3.9,45.2 3.9,46.96 arc-90 4.39,47.45 4.72,47.45 arc-90 RESET.2
N$26
  Top 0.406: R2.1 3.17,25.79 arc-90 LED1.A
N$27
  Top 0.406: R4.1 20.31,28.63 arc-90 22.38,26.56 arc90 24.27,24.67 NUCLEO_STM32.13
N$28
  Top 0.406: R9.1 14.32,23.08 arc90 16.86,20.54 21.03,20.54 arc90 22.69,22.19 22.69,23.31 arc-90 23.25,23.87 NUCLEO_STM32.14
N$29
  Top 0.406: J2.5 9.88,28.67 R4.2
N$30
  Top 0.406: J2.4 12.42,23.56 R9.2
VCC
  Top 0.406: BATTERY_CHARGER.B+ 36.66,61.04 arc-90 39.2,58.5 39.2,56.57 arc90 41.74,54.03 BATTERY.+